# EAGLE design controlmodule-ra-12 (EAGLE 9.6.2)
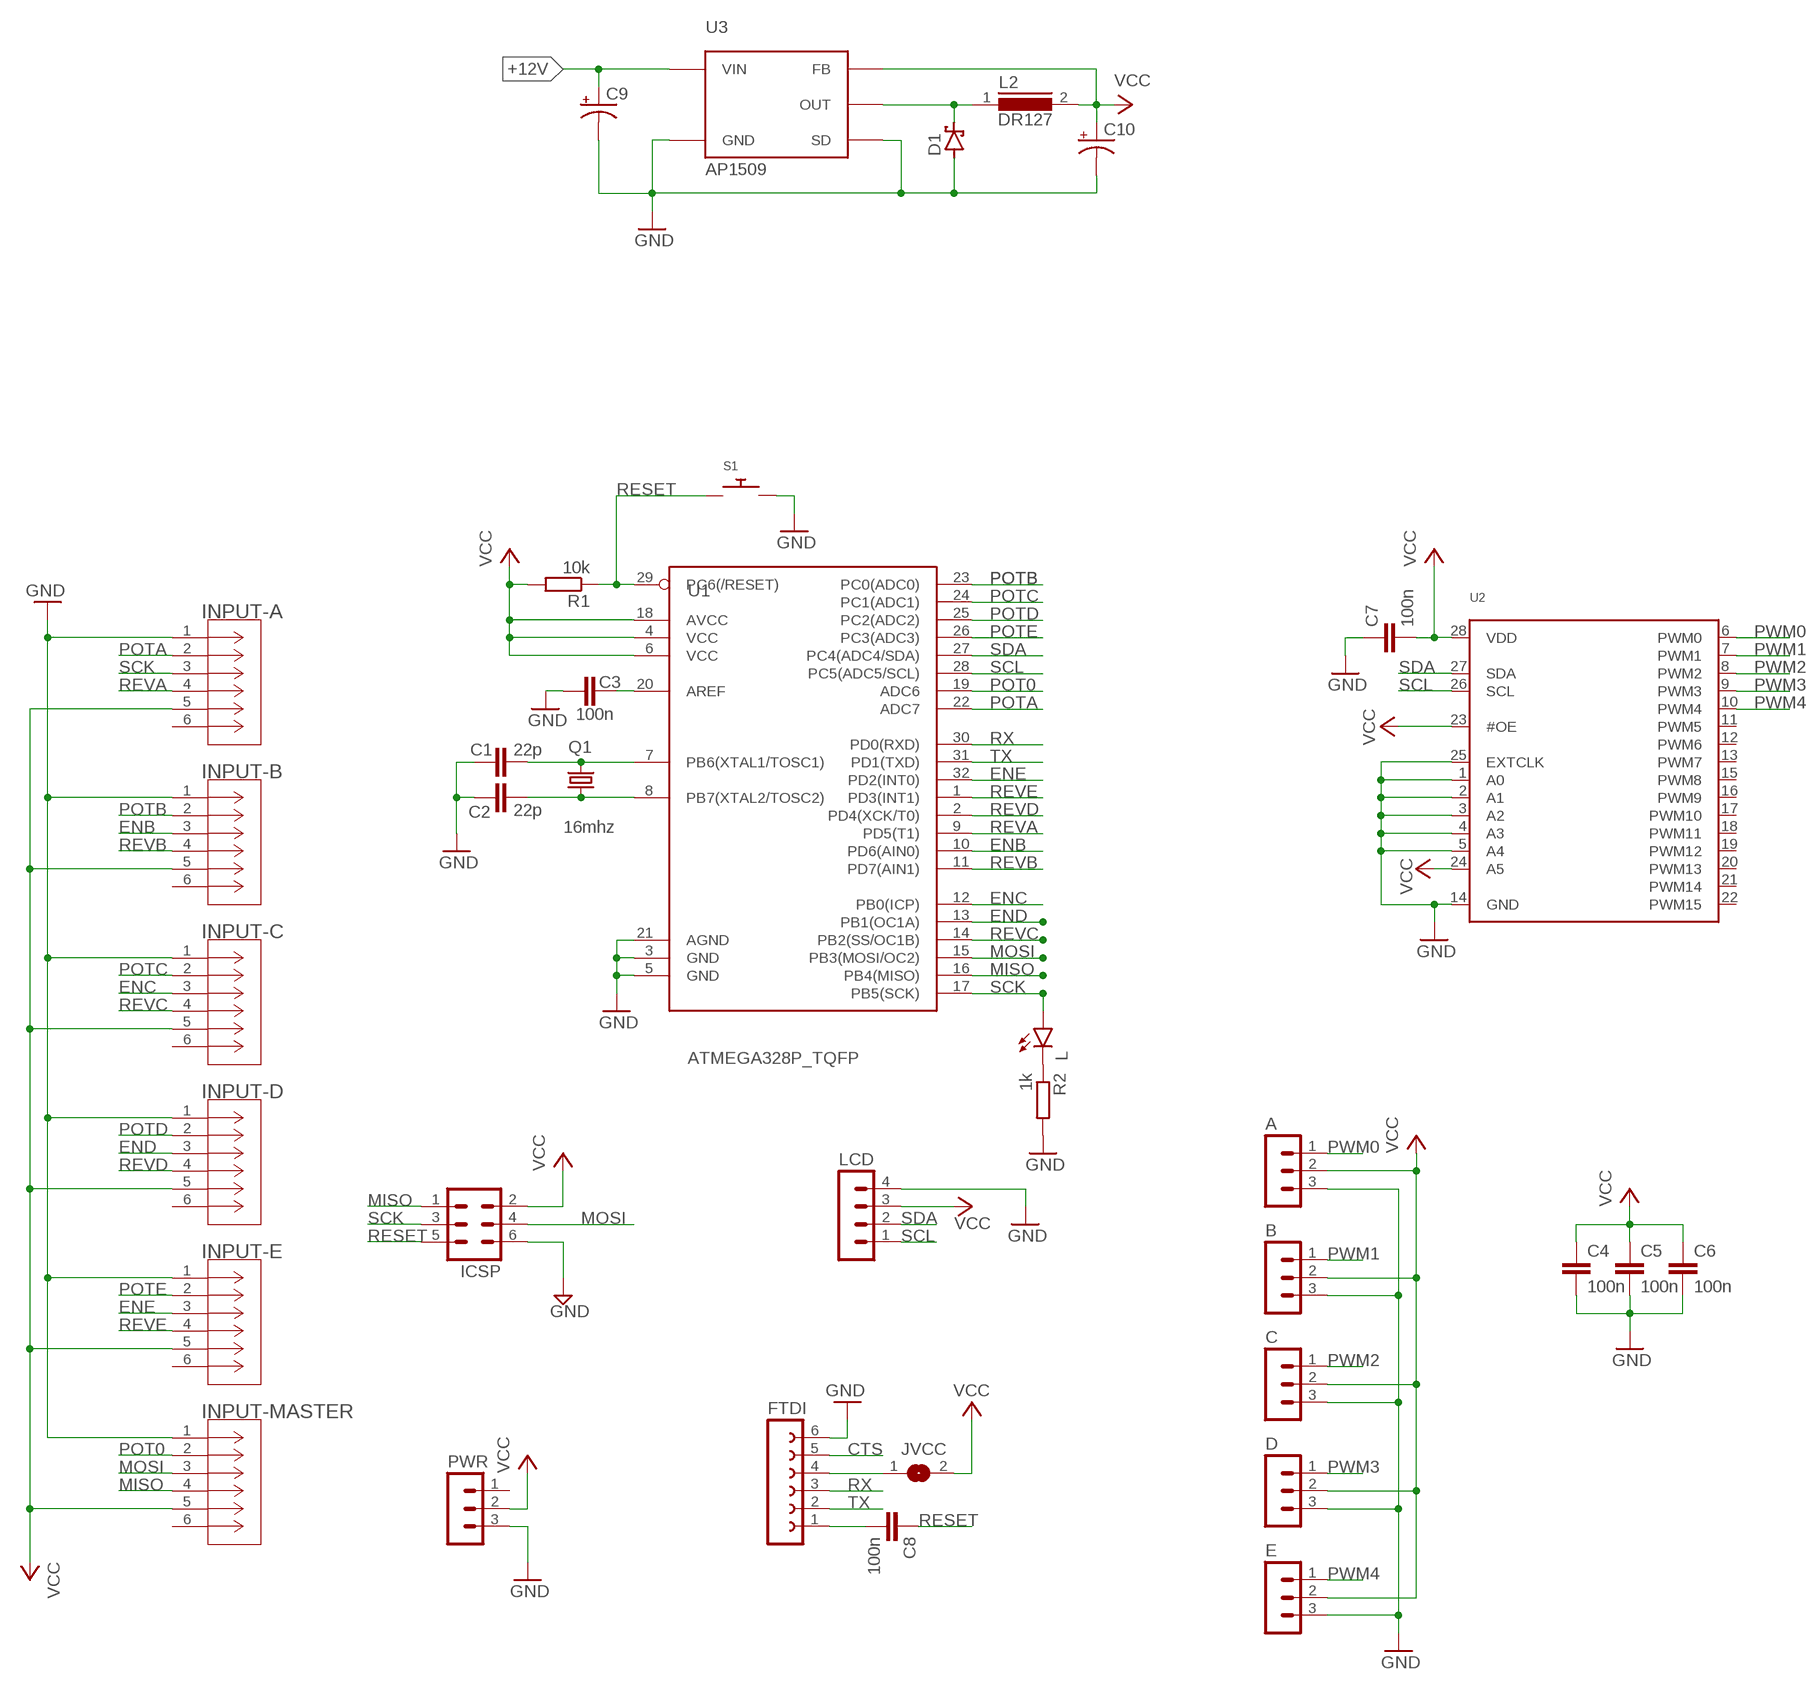
[diagram p0: schematic, sheet 1]

## Parts
A  MOLEX-SL-3PIN-RA-BOARD-LOCK  [MOLEX-SL-3PIN-RA-BOARD-LOCK]
B  MOLEX-SL-3PIN-RA-BOARD-LOCK  [MOLEX-SL-3PIN-RA-BOARD-LOCK]
C  MOLEX-SL-3PIN-RA-BOARD-LOCK  [MOLEX-SL-3PIN-RA-BOARD-LOCK]
C1  22p  C-EUC0805  [C0805]
C2  22p  C-EUC0805  [C0805]
C3  100n  C-EUC0805  [C0805]
C4  100n  C-EUC0805  [C0805]
C5  100n  C-EUC0805  [C0805]
C6  100n  C-EUC0805  [C0805]
C7  100n  C-EUC0805  [C0805]
C8  100n  C-EUC0805  [C0805]
C9  CPOL-US150CLZ-1010  [150CLZ-1010]
C10  CPOL-US150CLZ-1010  [150CLZ-1010]
D  MOLEX-SL-3PIN-RA-BOARD-LOCK  [MOLEX-SL-3PIN-RA-BOARD-LOCK]
D1  SCHOTTKY-DIODESMD  [SMB]
E  MOLEX-SL-3PIN-RA-BOARD-LOCK  [MOLEX-SL-3PIN-RA-BOARD-LOCK]
FTDI  FE06-1  [FE06]
ICSP  MA03-2  [MA03-2]
INPUT-A  B6B-PH-K-S(LF)(SN)-JST  [CONN_B6B-PH-K-S_JST]
INPUT-B  B6B-PH-K-S(LF)(SN)-JST  [CONN_B6B-PH-K-S_JST]
INPUT-C  B6B-PH-K-S(LF)(SN)-JST  [CONN_B6B-PH-K-S_JST]
INPUT-D  B6B-PH-K-S(LF)(SN)-JST  [CONN_B6B-PH-K-S_JST]
INPUT-E  B6B-PH-K-S(LF)(SN)-JST  [CONN_B6B-PH-K-S_JST]
INPUT-MASTER  B6B-PH-K-S(LF)(SN)-JST  [CONN_B6B-PH-K-S_JST]
JVCC  SJ  [SJ]
L  LEDCHIP-LED0805  [CHIP-LED0805]
L2  DR127  [DR127]
LCD  MOLEX-SL-4PIN-RA-BOARD-LOCK  [MOLEX-SL-4PIN-RA-BOARD-LOCK]
PWR  MOLEX-SL-3PIN-RA-BOARD-LOCK  [MOLEX-SL-3PIN-RA-BOARD-LOCK]
Q1  16mhz  CRYSTAL  [HC49UP]
R1  10k  R-EU_R0805  [R0805]
R2  1k  R-EU_R0805  [R0805]
S1  3X4MM-PUHSBUTTON  [3X4MM-PUSHBUTTON]
U1  ATMEGA328P_TQFP  [TQFP32-08]
U2  PCA9685  [TSSOP28]
U3  AP1509-SOP8L  [SOP-8L]

## Nets
+12V: C9.+ U3.1(VIN)
CTS: FTDI.5
ENB: INPUT-B.3 U1.10(PD6(AIN0))
ENC: INPUT-C.3 U1.12(PB0(ICP))
END: INPUT-D.3 U1.13(PB1(OC1A))
ENE: INPUT-E.3 U1.32(PD2(INT0))
GND: A.3 B.3 C1.1 C2.1 C3.2 C4.2 C5.2 C6.2 C7.1 C9.- C10.- C.3 D1.A D.3 E.3 FTDI.6 ICSP.6 INPUT-A.1 INPUT-B.1 INPUT-C.1 INPUT-D.1 INPUT-E.1 INPUT-MASTER.1 LCD.4 PWR.3 R2.2 S1.P$2 U1.3(GND) U1.5(GND) U1.21(AGND) U2.1(A0) U2.2(A1) U2.3(A2) U2.4(A3) U2.5(A4) U2.14(GND) U2.25(EXTCLK) U3.4(SD) U3.5(GND) U3.6(GND) U3.7(GND) U3.8(GND)
MISO: ICSP.1 INPUT-MASTER.4 U1.16(PB4(MISO))
MOSI: ICSP.4 INPUT-MASTER.3 U1.15(PB3(MOSI/OC2))
N$1: FTDI.4 JVCC.1
N$2: D1.C L2.1 U3.2(OUT)
N$3: L.C R2.1
N$8: C3.1 U1.20(AREF)
N$9: C8.2 FTDI.1
POT0: INPUT-MASTER.2 U1.19(ADC6)
POTA: INPUT-A.2 U1.22(ADC7)
POTB: INPUT-B.2 U1.23(PC0(ADC0))
POTC: INPUT-C.2 U1.24(PC1(ADC1))
POTD: INPUT-D.2 U1.25(PC2(ADC2))
POTE: INPUT-E.2 U1.26(PC3(ADC3))
PWM0: A.1 U2.6(PWM0)
PWM1: B.1 U2.7(PWM1)
PWM2: C.1 U2.8(PWM2)
PWM3: D.1 U2.9(PWM3)
PWM4: E.1 U2.10(PWM4)
RESET: C8.1 ICSP.5 R1.1 S1.P$1 U1.29(PC6(/RESET))
REVA: INPUT-A.4 U1.9(PD5(T1))
REVB: INPUT-B.4 U1.11(PD7(AIN1))
REVC: INPUT-C.4 U1.14(PB2(SS/OC1B))
REVD: INPUT-D.4 U1.2(PD4(XCK/T0))
REVE: INPUT-E.4 U1.1(PD3(INT1))
RX: FTDI.3 U1.30(PD0(RXD))
SCK: ICSP.3 INPUT-A.3 L.A U1.17(PB5(SCK))
SCL: LCD.1 U1.28(PC5(ADC5/SCL)) U2.26(SCL)
SDA: LCD.2 U1.27(PC4(ADC4/SDA)) U2.27(SDA)
TX: FTDI.2 U1.31(PD1(TXD))
VCC: A.2 B.2 C4.1 C5.1 C6.1 C7.2 C10.+ C.2 D.2 E.2 ICSP.2 INPUT-A.5 INPUT-B.5 INPUT-C.5 INPUT-D.5 INPUT-E.5 INPUT-MASTER.5 JVCC.2 L2.2 LCD.3 PWR.2 R1.2 U1.4(VCC) U1.6(VCC) U1.18(AVCC) U2.23(#OE) U2.24(A5) U2.28(VDD) U3.3(FB)
XTAL1: C1.2 Q1.2 U1.7(PB6(XTAL1/TOSC1))
XTAL2: C2.2 Q1.1 U1.8(PB7(XTAL2/TOSC2))
Unconnected: INPUT-A.6 INPUT-B.6 INPUT-C.6 INPUT-D.6 INPUT-E.6 INPUT-MASTER.6 PWR.1 U2.11(PWM5) U2.12(PWM6) U2.13(PWM7) U2.15(PWM8) U2.16(PWM9) U2.17(PWM10) U2.18(PWM11) U2.19(PWM12) U2.20(PWM13) U2.21(PWM14) U2.22(PWM15)

## Library data of the parts
A B C D E PWR = bidpl:MOLEX-SL-3PIN-RA-BOARD-LOCK
C1-C8 = rcl:C-EU: CAPACITOR, European symbol; SPICEPREFIX: C
C9 C10 = rcl:CPOL-US: POLARIZED CAPACITOR, American symbol; SPICEPREFIX: C
D1 = diode:SCHOTTKY-DIODE: Schottky Diode
FTDI = bidpl:FE06-1: FEMALE HEADER
ICSP = bidpl:MA03-2: PIN HEADER
INPUT-A INPUT-B INPUT-C INPUT-D INPUT-E INPUT-MASTER = bidpl:B6B-PH-K-S(LF)(SN)-JST; BUILT_BY: EMA_Cory; COPYRIGHT: Copyright (C) 2018 Accelerated Designs. All rights reserved; DATASHEET: http://www.jst-mfg.com/product/pdf/eng/ePH.pdf; MANUFACTURER_PART_NUMBER: B6B-PH-K-S(LF)(SN); SOURCELIBRARY: Add_to_database_2020-12-08; VENDOR: JST
JVCC = jumper:SJ: SMD solder JUMPER
L = led:LED: LED OSRAM: - CHIPLED LG R971, LG N971, LY N971, LG Q971, LY Q971, LO R971, LY R971 LH N974, LH R974 LS Q976, LO Q976, LY Q976 LO Q996 - Hyper CHIPLED LW Q18S LB Q993, LB Q99A, LB R99A - SideLED LS A670, LO A670, LY A670, LG A670, LP A670 LB A673, LV A673, LT A673, LW A673 LH A674 LY A675 LS A676, LA A676, LO A676, LY A676, LW A676 LS A679, LY A679, LG A679 - Hyper Micro SIDELED® LS Y876, LA Y876, LO Y876, LY Y876 LT Y87S - SmartLED LW L88C, LW L88S LB L89C, LB L89S, LG L890 LS L89K, LO L89K, LY L89K LS L896, LA L896, LO L896, LY L896 - TOPLED LS T670, LO T670, LY T670, LG T670, LP T670 LSG T670, LSP T670, LSY T670, LOP T670, LYG T670 LG T671, LOG T671, LSG T671 LB T673, LV T673, LT T673, LW T673 LH T674 LS T676, LA T676, LO T676, LY T676, LB T676, LH T676, LSB T676, LW T676 LB T67C, LV T67C, LT T67C, LS T67K, LO T67K, LY T67K, LW E67C LS E67B, LA E67B, LO E67B, LY E67B, LB E67C, LV E67C, LT E67C LW T67C LS T679, LY T679, LG T679 LS T770, LO T770, LY T770, LG T770, LP T770 LB T773, LV T773, LT T773, LW T773 LH T774 LS E675, LA E675, LY E675, LS T675 LS T776, LA T776, LO T776, LY T776, LB T776 LHGB T686 LT T68C, LB T68C - Hyper Mini TOPLED® LB M676 - Mini TOPLED Santana® LG M470 LS M47K, LO M47K, LY M47K Source: http://www.osram.convergy.de LUXEON: - LUMILED® LXK2-PW12-R00, LXK2-PW12-S00, LXK2-PW14-U00, LXK2-PW14-V00 LXK2-PM12-R00, LXK2-PM12-S00, LXK2-PM14-U00 LXK2-PE12-Q00, LXK2-PE12-R00, LXK2-PE12-S00, LXK2-PE14-T00, LXK2-PE14-U00 LXK2-PB12-K00, LXK2-PB12-L00, LXK2-PB12-M00, LXK2-PB14-N00, LXK2-PB14-P00, LXK2-PB14-Q00 LXK2-PR12-L00, LXK2-PR12-M00, LXK2-PR14-Q00, LXK2-PR14-R00 LXK2-PD12-Q00, LXK2-PD12-R00, LXK2-PD12-S00 LXK2-PH12-R00, LXK2-PH12-S00 LXK2-PL12-P00, LXK2-PL12-Q00, LXK2-PL12-R00 Source: www.luxeon.com KINGBRIGHT: KA-3528ASYC Source: www.kingbright.com
L2 = inductors:DR127: High Power Density, High Efficiency, Shielded Inductors Source: coiltronics_dr_series.pdf; SPICEPREFIX: L
LCD = bidpl:MOLEX-SL-4PIN-RA-BOARD-LOCK
Q1 = bidpl:CRYSTAL: CRYSTAL
R1 R2 = rcl:R-EU_: RESISTOR, European symbol; SPICEPREFIX: R
S1 = bidpl:3X4MM-PUHSBUTTON: https://ae01.alicdn.com/kf/HTB1vkExQpXXXXbFXFXXq6xXFXXXk/10PCS-2Pin-SMD-Mini-Button-Switch-Phone-Side-Push-3X4MM-Micro-Button-Switch-used-for-key.jpg_960x960.jpg
U1 = bidpl:ATMEGA328P_TQFP: Popular 328P in QFP Storefront component: ATmega328 - TQFP <https://www.sparkfun.com/products/13448> (COM-13448) Datasheet <http://www.sparkfun.com/datasheets/Components/SMD/ATMega328.pdf> SparkFun Products SparkFun RedBoard - Programmed with Arduino <https://www.sparkfun.com/products/12757> (DEV-12757) Arduino Pro Mini 328 - 5V/16MHz <https://www.sparkfun.com/products/11113> (DEV-11113) Arduino Pro Mini 328 - 3.3V/8MHz <https://www.sparkfun.com/products/11114> (DEV-11114) SparkFun OpenLog <https://www.sparkfun.com/products/13712> (DEV-13712) SparkFun MicroView - OLED Arduino Module <https://www.sparkfun.com/products/12923> (DEV-12923) SparkFun Digital Sandbox <https://www.sparkfun.com/products/12651> (DEV-12651) SparkFun PicoBoard <https://www.sparkfun.com/products/11888> (WIG-11888) Arduino Fio <https://www.sparkfun.com/products/10116> (DEV-10116) LilyPad Arduino 328 Main Board <https://www.sparkfun.com/products/13342> (DEV-13342) SparkFun RedStick <https://www.sparkfun.com/products/13741> (DEV-13741) LilyPad MP3 <https://www.sparkfun.com/products/11013> (DEV-11013) LilyPad Arduino SimpleSnap <https://www.sparkfun.com/products/10941> (DEV-10941) SparkFun Stepoko <https://www.sparkfun.com/products/13899> (ROB-13899) SparkFun Geiger Counter <https://www.sparkfun.com/products/11345> (SEN-11345) SparkFun EL Sequencer <https://www.sparkfun.com/products/12781> (COM-12781) Arduino Pro 328 - 5V/16MHz <https://www.sparkfun.com/products/10915> (DEV-10915) CryptoCape <https://www.sparkfun.com/products/12773> (DEV-12773) SparkFun IR Thermometer Evaluation Board - MLX90614 <https://www.sparkfun.com/products/10740> (SEN-10740) SparkFun RedBot Mainboard <https://www.sparkfun.com/products/12097> (ROB-12097) Arduino Pro 328 - 3.3V/8MHz <https://www.sparkfun.com/products/10914> (DEV-10914) SparkFun Block for Intel® Edison - Arduino <https://www.sparkfun.com/products/13036> (DEV-13036) SparkFun Simon Says - Surface Mount Soldering Kit <https://www.sparkfun.com/products/10935> (KIT-10935) SparkFun 7-Segment Serial Display - Red <https://www.sparkfun.com/products/11441> (COM-11441) SparkFun 7-Segment Serial Display - White <https://www.sparkfun.com/products/11629> (COM-11629) SparkFun 7-Segment Serial Display - Yellow <https://www.sparkfun.com/products/11443> (COM-11443) SparkFun 7-Segment Serial Display - Kelly Green <https://www.sparkfun.com/products/11440> (COM-11440) SparkFun 7-Segment Serial Display - Blue <https://www.sparkfun.com/products/11442> (COM-11442) SparkFun OpenSegment Serial Display - 20mm (Blue) <https://www.sparkfun.com/products/11647> (COM-11647) SparkFun OpenSegment Serial Display - 20mm (Green) <https://www.sparkfun.com/products/11646> (COM-11646) SparkFun OpenSegment Serial Display - 20mm (White) <https://www.sparkfun.com/products/11648> (COM-11648) SparkFun OpenSegment Serial Display - 20mm (Red) <https://www.sparkfun.com/products/11644> (COM-11644) SparkFun OpenSegment Serial Display - 20mm (Yellow) <https://www.sparkfun.com/products/11645> (COM-11645) SparkFun OpenSegment Shield <https://www.sparkfun.com/products/13190> (DEV-13190); PROD_ID: IC-09069
U2 = bidpl:PCA9685: PCA9685 - 16 Channel 12-Bit I2C PWM Controller 5.0V tolerant 16 channel, 12-bit I2C PWM controller with 25mA per output (max. 400mA total) Digikey: 568-5931-1-ND
U3 = kanflo:AP1509: AP1509 150kHz 2A PWM Buck DC/DC Converter

## Board
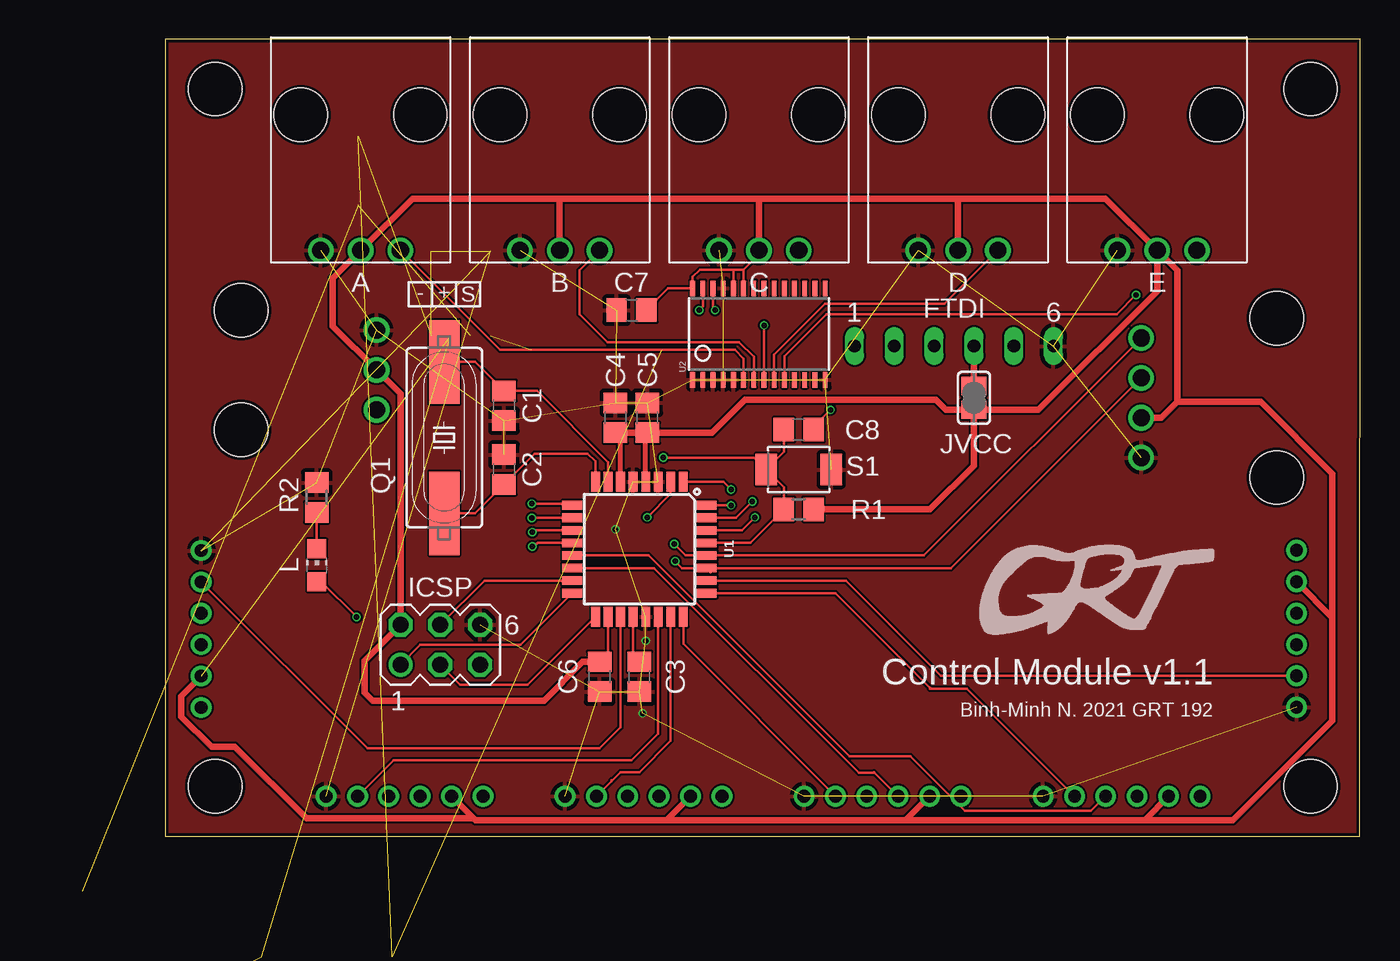
[diagram p1: board, top side]
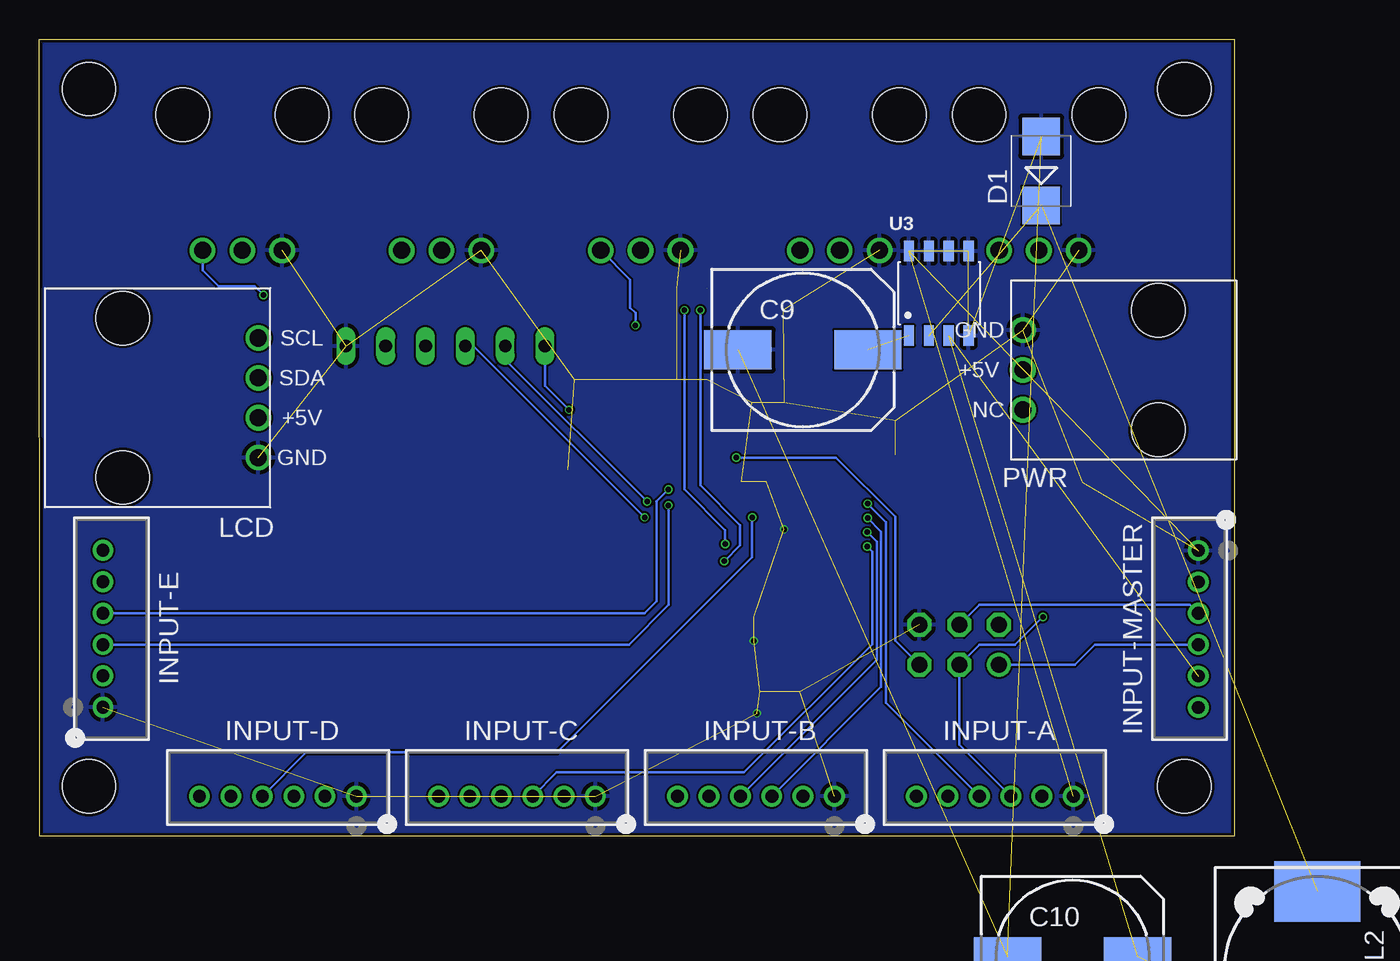
[diagram p2: board, bottom side, seen from below]

Size 76.2 x 50.8 mm. Coordinates in mm from the lower left corner, seen from the top.
Outline: 0,0 76.18,0 76.2,50.8 0,50.8 0,0
Copper layers (1*16): Top 0.035559375mm / dielectric 1.6mm / Bottom 0.035559375mm
Design rules "jlcpcb2layer": minimum track width 5mil, minimum drill 12mil, track to track 5mil, track to pad 5mil, pad to pad 5mil, via to via 5mil, smd to smd 5mil, copper to edge 8mil, drill to drill 6mil, minimum pad ring 5mil, minimum via ring 3mil, stop-mask expansion 2.5mil, vias tented up to drill 0mil, thermal gap 10mil
Holes 3.4 mm at 3.17,3.17 73.03,3.17 73.03,47.62 3.17,47.62

### Footprints (pad centres in the part's own frame; a part is rotated, then mirrored left to right if it is on the bottom)
MOLEX-SL-3PIN-RA-BOARD-LOCK = drill 1.092: 1 2.54,0; 2 0,0; 3 -2.54,0 | hole 3.404: -3.81,8.636; 3.81,8.636
C0805 = smd 1.3 x 1.5: 1 -0.95,0; 2 0.95,0
150CLZ-1010 = smd 4.3 x 2.5: + 4.15,0; - -4.15,0
SMB = smd 2.4 x 2.4: A 2.2,0; C -2.2,0
FE06 = drill 0.813 long: 1 -6.35,0; 2 -3.81,0; 3 -1.27,0; 4 1.27,0; 5 3.81,0; 6 6.35,0
MA03-2 = drill 1.016: 1 -2.54,-1.27 | drill 1.016 octagon: 2 -2.54,1.27; 3 0,-1.27; 4 0,1.27; 5 2.54,-1.27; 6 2.54,1.27
CONN_B6B-PH-K-S_JST = drill 0.813 pad 1.321: 1 -4.991,0; 2 -2.985,0; 3 -1.003,0; 4 1.003,0; 5 3.01,0; 6 5.016,0
SJ = smd 1.168 x 1.6: 1 -0.762,0; 2 0.762,0
CHIP-LED0805 = smd 1.2 x 1.2: A 0,-1.05; C 0,1.05
DR127 = smd 3.85 x 5.5: 1 -4.975,0; 2 4.975,0
MOLEX-SL-4PIN-RA-BOARD-LOCK = drill 1.092: 1 3.81,0; 2 1.27,0; 3 -1.27,0; 4 -3.81,0 | hole 3.404: -5.08,8.636; 5.08,8.636
HC49UP = smd 5.334 x 1.93: 1 -4.826,0; 2 4.826,0
R0805 = smd 1.3 x 1.5: 1 -0.95,0; 2 0.95,0
3X4MM-PUSHBUTTON = smd 1.35 x 2: P$1 -2.075,0; P$2 2.075,0
TQFP32-08 = smd 1.27 x 0.559: 1 -4.293,2.8; 2 -4.293,2; 3 -4.293,1.2; 4 -4.293,0.4; 5 -4.293,-0.4; 6 -4.293,-1.2; 7 -4.293,-2; 8 -4.293,-2.8; 17 4.293,-2.8; 18 4.293,-2; 19 4.293,-1.2; 20 4.293,-0.4; 21 4.293,0.4; 22 4.293,1.2; 23 4.293,2; 24 4.293,2.8 | smd 0.559 x 1.27: 9 -2.8,-4.293; 10 -2,-4.293; 11 -1.2,-4.293; 12 -0.4,-4.293; 13 0.4,-4.293; 14 1.2,-4.293; 15 2,-4.293; 16 2.8,-4.293; 25 2.8,4.293; 26 2,4.293; 27 1.2,4.293; 28 0.4,4.293; 29 -0.4,4.293; 30 -1.2,4.293; 31 -2,4.293; 32 -2.8,4.293
TSSOP28 = smd 0.305 x 0.991: 1 -4.225,-2.918; 2 -3.575,-2.918; 3 -2.925,-2.918; 4 -2.275,-2.918; 5 -1.625,-2.918; 6 -0.975,-2.918; 7 -0.325,-2.918; 8 0.325,-2.918; 9 0.975,-2.918; 10 1.625,-2.918; 11 2.275,-2.918; 12 2.925,-2.918; 13 3.575,-2.918; 14 4.225,-2.918; 15 4.225,2.918; 16 3.575,2.918; 17 2.925,2.918; 18 2.275,2.918; 19 1.625,2.918; 20 0.975,2.918; 21 0.325,2.918; 22 -0.325,2.918; 23 -0.975,2.918; 24 -1.625,2.918; 25 -2.275,2.918; 26 -2.925,2.918; 27 -3.575,2.918; 28 -4.225,2.918
SOP-8L = smd 0.65 x 1.3: 1 -1.94,-2.69; 2 -0.67,-2.69; 3 0.6,-2.69; 4 1.87,-2.69; 5 1.87,2.69; 6 0.6,2.69; 7 -0.67,2.69; 8 -1.94,2.69

### Placement (x,y rotation side)
A  12.45,37.34 0 top
B  25.15,37.34 0 top
C  37.85,37.34 0 top
C1  21.59,27.43 90 top
C2  21.59,23.37 270 top
C3  30.23,10.16 270 top
C4  28.7,26.67 90 top
C5  30.73,26.67 90 top
C6  27.69,10.16 270 top
C7  29.72,33.53 0 top
C8  40.39,25.91 0 top
C9  27.5,31 0 bottom
C10  10.3,-7.7 0 bottom  (outside the outline)
D  50.55,37.34 0 top
D1  12.3,42.4 90 bottom
E  63.25,37.34 0 top
FTDI  50.29,31.24 0 top
ICSP  17.53,12.19 0 top
INPUT-A  15.24,2.54 180 bottom
INPUT-B  30.48,2.54 180 bottom
INPUT-C  45.72,2.54 180 bottom
INPUT-D  60.96,2.54 180 bottom
INPUT-E  72.14,13.21 90 bottom
INPUT-MASTER  2.29,13.21 270 bottom
JVCC  51.56,27.94 270 top
L  9.65,17.27 0 top
L2  -5.3,-8.5 270 bottom  (outside the outline)
LCD  62.23,27.94 90 bottom
PWR  13.46,29.72 270 bottom
Q1  17.78,25.4 90 top
R1  40.39,20.83 0 top
R2  9.65,21.59 90 top
S1  40.39,23.37 0 top
U1  30.23,18.29 270 top
U2  37.85,32 0 top
U3  18.8,34.6 0 bottom

### Tracks (layer width: path | path; a pad name or v marks a point on that pad's centre or on a via)
+12V  (1 unrouted)
ENB  (via drill 0.35)
  Top 0.152: v23.37,20.28 v23.38,20.29 U1.10
  Bottom 0.152: v23.37,20.28 22.5,19.42 22.5,9.91 22.5,9.51 INPUT-B.3
ENC  (via drill 0.35)
  Top 0.152: U1.12 23.77,18.69 v23.39,18.46
  Bottom 0.152: INPUT-C.3 43.19,4.06 31.24,4.06 23.06,12.24 23.06,18.13 v23.39,18.46
END
  Top 0.152: U1.13 30.8,17.89 43.61,5.08 47.5,5.08 50.98,1.6 59.02,1.6 INPUT-D.3
ENE  (via drill 0.35)
  Top 0.152: U1.32 v36.06,21.09 v36.07,21.08
  Bottom 0.152: v36.07,21.08 36.07,14.73 38.59,12.21 INPUT-E.3
GND  (via drill 0.35)  (44 unrouted)
  other vias: 30.63,12.45 28.7,19.56 30.43,7.82
  pour Top: -0.51,-0.51 76.71,-0.51 76.71,51.05 -0.51,51.05
  pour Bottom: -1.27,50.8 -1.27,-1.27 77.47,-1.27 77.47,50.8
MISO
  Top 0.152: ICSP.1 16.26,12.19 22.64,12.19 U1.16
  Bottom 0.152: INPUT-MASTER.4 8.88,12.21 10.16,10.92 ICSP.1
MOSI
  Top 0.152: ICSP.4 20.35,16.29 U1.15
  Bottom 0.152: INPUT-MASTER.3 2.81,14.73 16.26,14.73 ICSP.4
N$1
  Top 0.406: FTDI.4 JVCC.1
N$2  (2 unrouted)
N$3
  Top 0.152: R2.1 L.C
N$8
  Top 0.152: C3.1 29.83,11.51 U1.20
N$9  (via drill 0.35)
  Top 0.152: v42.42,27.18 41.34,26.1 C8.2
  Bottom 0.152: FTDI.1 43.94,28.7 v42.42,27.18
POT0
  Top 0.152: U1.19 29.03,6.93 27.69,5.59 12.89,5.59 INPUT-MASTER.2
POTA
  Top 0.152: U1.22 31.43,6.53 29.72,4.83 14.54,4.83 INPUT-A.2
POTB
  Top 0.152: U1.23 32.23,6.06 30.23,4.06 29.02,4.06 28.45,3.49 | INPUT-B.2 28.45,3.49 | 28.45,3.49 28.45,3.56
POTC
  Top 0.152: U1.24 33.03,12.25 INPUT-C.2
POTD
  Top 0.152: U1.25 42.74,15.49 48.77,9.46 48.77,9.4 51.12,9.4 INPUT-D.2
POTE
  Top 0.152: U1.26 43.4,16.29 49.47,10.22 INPUT-E.2
PWM0
  Top 0.152: U2.6 36.87,30.44 36.32,30.99 21.34,30.99 A.1
PWM1
  Top 0.152: B.1 26.42,36.07 26.42,33.27 28.19,31.5 36.58,31.5 37.52,30.55 U2.7
PWM2  (via drill 0.35)
  Top 0.152: U2.8 v38.17,32.56 v38.18,32.56
  Bottom 0.152: v38.18,32.56 38.18,33.35 38.51,33.68 38.51,35.46 C.1
PWM3
  Top 0.152: U2.9 38.82,30.69 42.06,33.93 49.6,33.93 49.68,33.93 D.1
PWM4  (via drill 0.35)
  Top 0.152: U2.10 39.47,30.58 42.16,33.27 60.67,33.27 v61.9,34.5
  Bottom 0.152: E.1 65.79,36.07 64.77,35.05 62.45,35.05 v61.9,34.5
RESET  (via drill 0.35)
  Top 0.152: U1.29 37.3,18.69 R1.1 39.44,22.24 S1.P$1 | S1.P$1 39.44,24.49 C8.1 | S1.P$1 37.55,24.13 v31.75,24.13
  Bottom 0.152: ICSP.5 21.59,12.45 21.59,20.34 25.38,24.13 v31.75,24.13
REVA  (via drill 0.35)
  Top 0.152: v23.37,21.19 25.83,21.19 U1.9
  Bottom 0.152: v23.37,21.19 22.2,20.02 22.2,8.89 22.2,8.5 INPUT-A.4
REVB  (via drill 0.35)
  Top 0.152: U1.11 23.51,19.49 v23.39,19.37
  Bottom 0.152: v23.39,19.37 22.78,18.76 22.78,11.24 INPUT-B.4
REVC
  Top 0.152: U1.14 31.17,17.09 44.22,4.04 45.23,4.04 INPUT-C.4 45.2,4.06
REVD  (via drill 0.35)
  Top 0.152: v30.73,20.32 32.23,21.81 U1.2
  Bottom 0.152: v30.73,20.32 30.73,17.78 43.18,5.33 59.17,5.33 INPUT-D.4
REVE  (via drill 0.35)
  Top 0.152: U1.1 35.59,22.58 v36.07,22.1
  Bottom 0.152: v36.07,22.1 36.83,21.34 36.83,14.99 37.6,14.21 INPUT-E.4
RX  (via drill 0.35)
  Top 0.152: U1.30 36.76,19.49 v37.59,20.32
  Bottom 0.152: FTDI.3 48.51,31.24 v37.59,20.32
SCK  (via drill 0.35)
  Top 0.152: U1.17 23.08,9.65 18.8,9.65 ICSP.3 | L.A 9.94,16.22 v12.19,13.97
  Bottom 0.152: v12.19,13.97 13.97,12.19 16.26,12.19 ICSP.3 17.53,5.83 INPUT-A.3
SCL  (via drill 0.35)
  Top 0.152: v32.46,18.61 33.18,17.89 U1.28 48.37,17.89 LCD.1 | v35.05,33.53 34.92,33.66 U2.26
  Bottom 0.152: v32.46,18.61 32.46,19.5 35.05,22.1 v35.05,33.53
SDA  (via drill 0.35)
  Top 0.152: U1.27 34.77,16.83 | U1.27 32.95,17.09 v32.51,17.53 | U2.27 34.27,33.76 v34.04,33.53 | U1.27 50.11,17.09 LCD.2
  Bottom 0.152: v32.51,17.53 31.5,18.54 31.5,19.81 34.04,22.35 v34.04,33.53
TX  (via drill 0.35)
  Top 0.152: U1.31 36.39,20.29 v37.44,21.34
  Bottom 0.152: v37.44,21.34 46.48,30.38 FTDI.2
VCC  (5 unrouted)
  Top 0.152: C6.1 28.23,11.65 U1.18 | 30.63,25.61 C5.1 | 29.03,25.4 C4.1 | U2.23 36.87,36.11 | 36.87,36.11 37.85,37.08 C.2 | 36.87,36.11 36.22,36.11 | 36.22,36.11 34.08,36.11 33.62,35.65 U2.28 32.06,34.92 C7.2 | U2.24 36.22,36.11
  Top 0.305: U1.4 30.63,25.4 30.63,25.61 | U1.6 29.03,25.4
  Top 0.406: INPUT-A.5 19.67,1.12 | 19.67,1.12 19.77,1.02 31.97,1.02 | INPUT-B.5 31.97,1.02 | 47.21,1.02 31.97,1.02 | 47.21,1.02 INPUT-C.5 | 47.21,1.02 62.45,1.02 | 62.45,1.02 INPUT-D.5 | 62.45,1.02 68.07,1.02 74.42,7.37 74.42,13.93 | 74.42,13.93 INPUT-E.5 | 19.67,1.12 9,1.12 4.42,5.7 2.94,5.7 1.02,7.62 1.02,8.93 INPUT-MASTER.5 | E.2 59.94,40.64 50.55,40.64 | 50.55,40.64 37.85,40.64 | 37.85,40.64 25.15,40.64 | D.2 50.55,40.64 | C.2 37.85,40.64 | 74.42,13.93 74.42,23.11 69.85,27.69 64.52,27.69 | C6.1 26.6,11.11 24.13,8.64 13.21,8.64 12.7,9.14 12.7,11.18 ICSP.2 14.99,28.19 PWR.2 10.67,32.51 10.67,35.56 A.2 15.75,40.64 25.15,40.64 | R1.2 48.77,20.83 51.56,23.62 JVCC.2 | C4.1 30.31,25.72 30.63,25.4 | C5.1 34.86,25.72 36.96,27.81 49.15,27.81 49.78,27.18 JVCC.2 | B.2 25.15,40.64 | LCD.3 63.5,26.67 64.52,27.69 | 64.52,27.69 64.52,36.07 E.2 | JVCC.2 55.68,27.18 63.25,34.75 E.2
XTAL1
  Top 0.152: Q1.2 19.75,30.23 C1.2 23.69,28.38 28.23,23.84 U1.7
XTAL2
  Top 0.152: Q1.1 19.75,20.57 C2.2 23.56,24.38 26.92,24.38 27.43,23.88 U1.8

### Text on the board
tPlace: - | + | S | Control Module v1.1 | Binh-Minh N. 2021 GRT 192
bPlace: GND | SCL | +5V | SDA | NC | +5V | GND